# EAGLE design working (EAGLE 9.6.2)
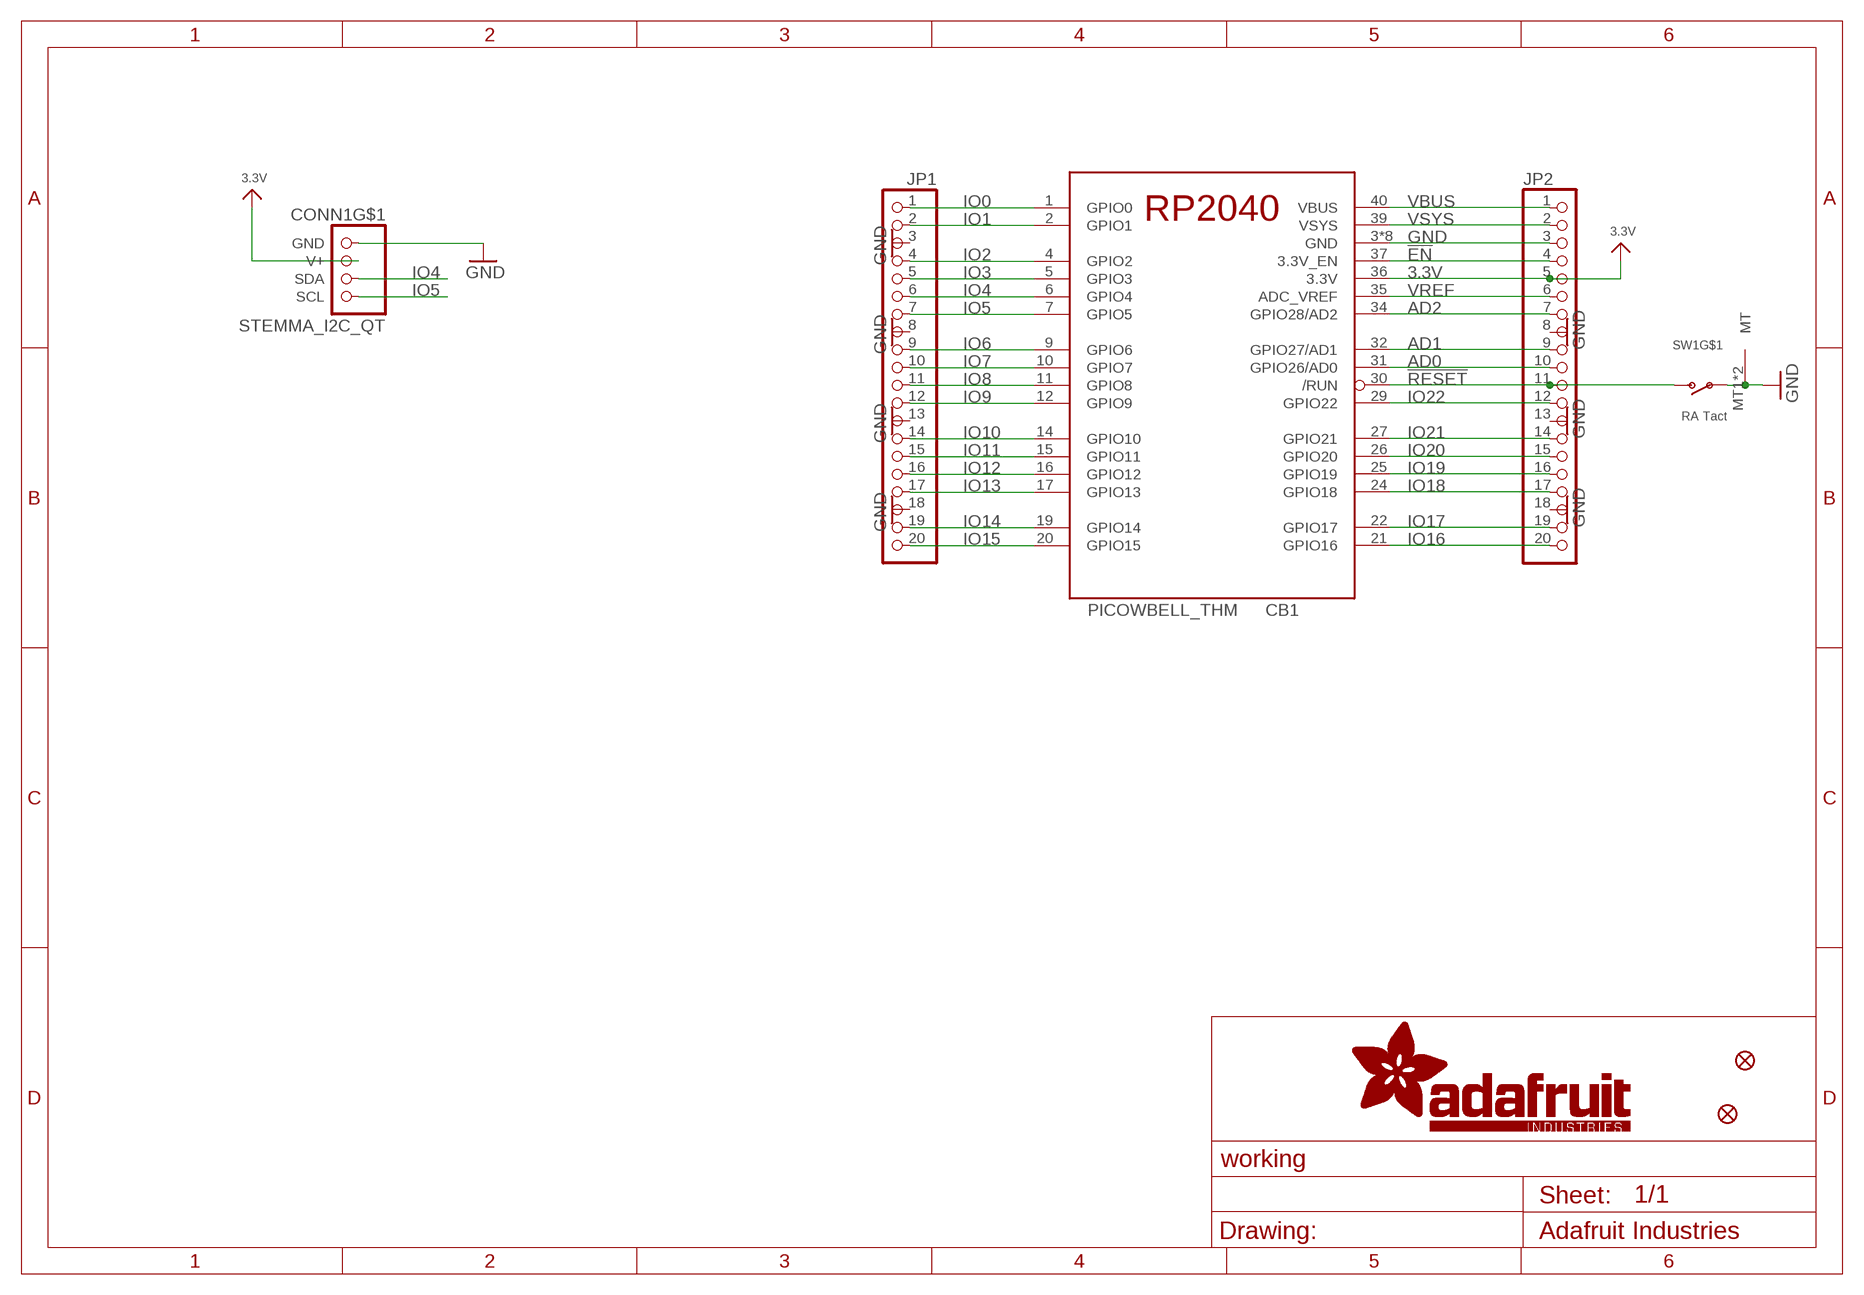
[diagram p0: schematic, sheet 1]

## Parts
CB1  PICOWBELL_THM  [PICOWBELL]
CONN1  STEMMA_I2C_QT  [JST_SH4]
FID1  FIDUCIAL_1MM  [FIDUCIAL_1MM]
FID2  FIDUCIAL_1MM  [FIDUCIAL_1MM]
JP1  HEADER-1X20_70MIL  [1X20_ROUND_70MIL]
JP2  HEADER-1X20_70MIL  [1X20_ROUND_70MIL]
SW1  RA Tact  SWITCH_SPST_MNT_TACT_RA  [SPST_TACTILE_RA]

## Nets
3.3V: CB1.36(3.3V) CONN1.2(V+) JP2.5
!EN: CB1.37(3.3V_EN) JP2.4
!RESET: CB1.30(/RUN) JP2.11 SW1.2(S)
AD0: CB1.31(GPIO26/AD0) JP2.10
AD1: CB1.32(GPIO27/AD1) JP2.9
AD2: CB1.34(GPIO28/AD2) JP2.7
GND: CB1.3(GND) CB1.8(GND) CB1.13(GND) CB1.18(GND) CB1.23(GND) CB1.28(GND) CB1.33(GND) CB1.38(GND) CONN1.1(GND) JP1.3 JP1.8 JP1.13 JP1.18 JP2.3 JP2.8 JP2.13 JP2.18 SW1.1(P) SW1.MT1(MT) SW1.MT2(MT)
IO0: CB1.1(GPIO0) JP1.1
IO1: CB1.2(GPIO1) JP1.2
IO2: CB1.4(GPIO2) JP1.4
IO3: CB1.5(GPIO3) JP1.5
IO4: CB1.6(GPIO4) CONN1.3(SDA) JP1.6
IO5: CB1.7(GPIO5) CONN1.4(SCL) JP1.7
IO6: CB1.9(GPIO6) JP1.9
IO7: CB1.10(GPIO7) JP1.10
IO8: CB1.11(GPIO8) JP1.11
IO9: CB1.12(GPIO9) JP1.12
IO10: CB1.14(GPIO10) JP1.14
IO11: CB1.15(GPIO11) JP1.15
IO12: CB1.16(GPIO12) JP1.16
IO13: CB1.17(GPIO13) JP1.17
IO14: CB1.19(GPIO14) JP1.19
IO15: CB1.20(GPIO15) JP1.20
IO16: CB1.21(GPIO16) JP2.20
IO17: CB1.22(GPIO17) JP2.19
IO18: CB1.24(GPIO18) JP2.17
IO19: CB1.25(GPIO19) JP2.16
IO20: CB1.26(GPIO20) JP2.15
IO21: CB1.27(GPIO21) JP2.14
IO22: CB1.29(GPIO22) JP2.12
VBUS: CB1.40(VBUS) JP2.1
VREF: CB1.35(ADC_VREF) JP2.6
VSYS: CB1.39(VSYS) JP2.2
Unconnected: CONN1.MT1(MT) CONN1.MT2(MT)

## Library data of the parts
CB1 = adafruit_micro:PICOWBELL
CONN1 = adafruit_electromech:STEMMA_I2C; LCSC: C2845363
FID1 FID2 = microbuilder:FIDUCIAL: Fiducial Alignment Points Various fiducial points for machine vision alignment.; BOM: EXCLUDE
JP1 JP2 = adafruit_electromech:HEADER-1X20
SW1 = adafruit_electromech:SWITCH_SPST_MNT: Switch - SPST 4UCon 19192 (6.7x2.6mm SMT); LCSC: C778158

## Board
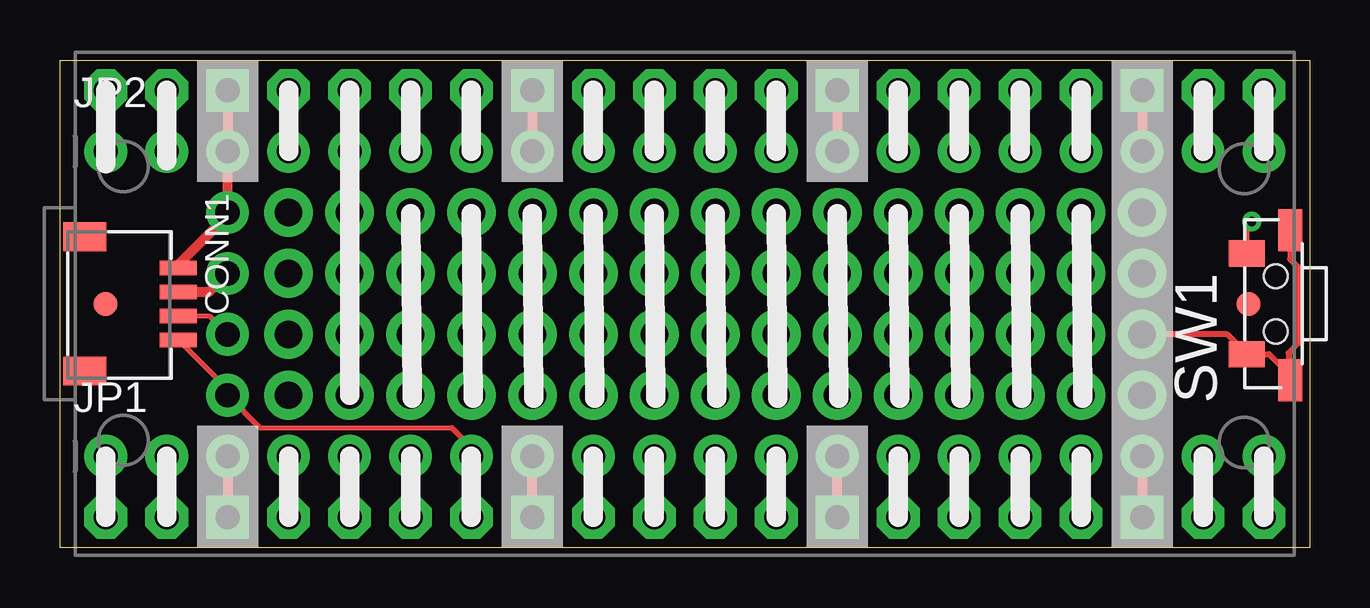
[diagram p1: board, top side]
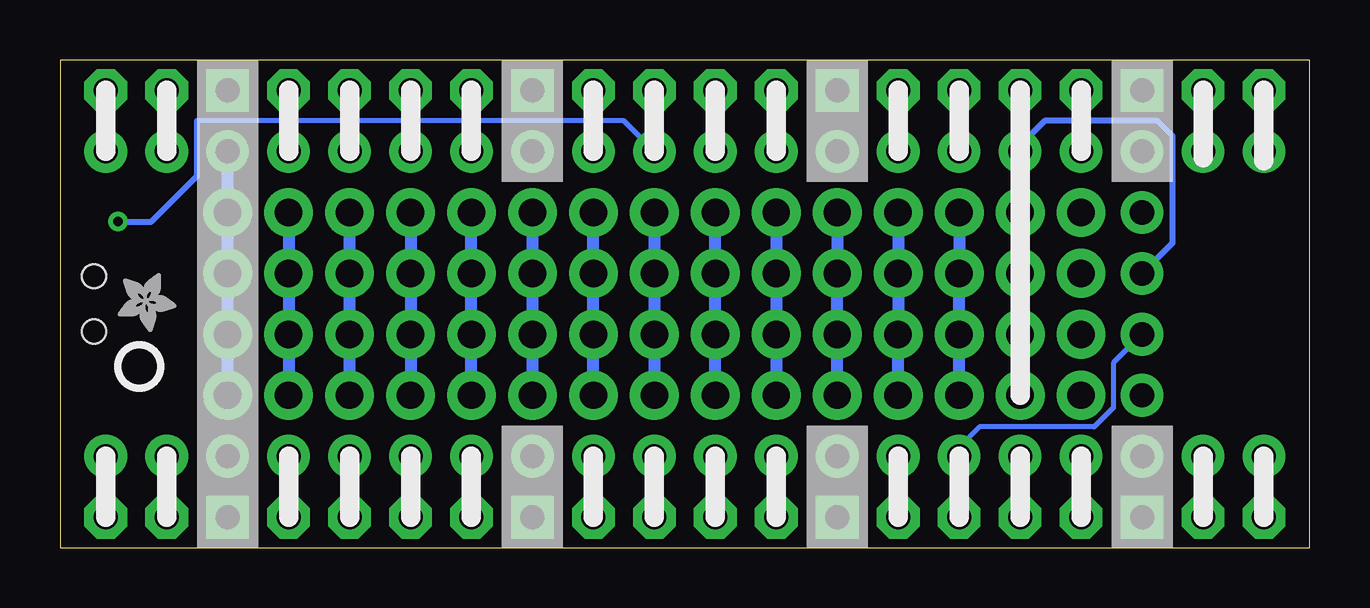
[diagram p2: board, bottom side, seen from below]

Size 52.07 x 20.32 mm. Coordinates in mm from the lower left corner, seen from the top.
Outline: 0,0 0,20.32 52.07,20.32 52.07,0 0,0
Copper layers (1*16): Top 0.035mm / dielectric 1.5mm / Bottom 0.035mm
Design rules "adafruit": minimum track width 8mil, minimum drill 15.5mil, track to track 8mil, track to pad 8mil, pad to pad 8mil, via to via 8mil, smd to smd 8mil, copper to edge 10mil, drill to drill 8mil, minimum pad ring 10mil, minimum via ring 8mil, stop-mask expansion 2mil, vias tented up to drill 20mil, thermal gap 10mil

### Footprints (pad centres in the part's own frame; a part is rotated, then mirrored left to right if it is on the bottom)
PICOWBELL = drill 1 pad 1.778 octagon: 1 1.27,0; 2 3.81,0; 4 8.89,0; 5 11.43,0; 6 13.97,0; 7 16.51,0; 9 21.59,0; 10 24.13,0; 11 26.67,0; 12 29.21,0; 14 34.29,0; 15 36.83,0; 16 39.37,0; 17 41.91,0; 19 46.99,0; 20 49.53,0; 21 49.53,17.78; 22 46.99,17.78; 24 41.91,17.78; 25 39.37,17.78; 26 36.83,17.78; 27 34.29,17.78; 29 29.21,17.78; 30 26.67,17.78; 31 24.13,17.78; 32 21.59,17.78; 34 16.51,17.78; 35 13.97,17.78; 36 11.43,17.78; 37 8.89,17.78; 39 3.81,17.78; 40 1.27,17.78 | drill 1 pad 1.778 square: 3 6.35,0; 8 19.05,0; 13 31.75,0; 18 44.45,0; 23 44.45,17.78; 28 31.75,17.78; 33 19.05,17.78; 38 6.35,17.78
JST_SH4 = smd 0.6 x 1.55: 1 -1.5,2.006; 2 -0.5,2.006; 3 0.5,2.006; 4 1.5,2.006 | smd 1.2 x 1.8: MT1 -2.8,-1.894; MT2 2.8,-1.894
FIDUCIAL_1MM = smd 1 x 1: 1 0,0
1X20_ROUND_70MIL = drill 1 pad 1.778: 1 -24.13,0; 2 -21.59,0; 3 -19.05,0; 4 -16.51,0; 5 -13.97,0; 6 -11.43,0; 7 -8.89,0; 8 -6.35,0; 9 -3.81,0; 10 -1.27,0; 11 1.27,0; 12 3.81,0; 13 6.35,0; 14 8.89,0; 15 11.43,0; 16 13.97,0; 17 16.51,0; 18 19.05,0; 19 21.59,0; 20 24.13,0
SPST_TACTILE_RA = smd 1.1 x 1.5: 1 2.1,-0.9; 2 -2.1,-0.9 | smd 1.75 x 1: MT1 3.175,0.9; MT2 -3.075,0.9 | hole 1: 1.15,0.3; -1.15,0.3

### Placement (x,y rotation side)
CB1  0.64,1.27 0 top
CONN1  2.92,10.16 270 top
FID1  1.91,10.16 0 top
FID2  49.53,10.16 0 top
JP1  26.04,3.81 0 top
JP2  26.04,16.51 0 top
PLABEL0  [PLABEL0]  47.88,10.16 270 top
PLABEL1  [PLABEL1]  3.43,2.54 0 top
PLABEL2  [PLABEL2]  0.89,2.54 0 top
PLABEL3  [PLABEL3]  8.7,2.6 0 top
PLABEL4  [PLABEL4]  11.05,2.54 0 top
PLABEL5  [PLABEL5]  13.59,2.54 0 top
PLABEL6  [PLABEL6]  16.13,2.54 0 top
PLABEL7  [PLABEL7]  21.4,2.54 0 top
PLABEL8  [PLABEL8]  23.75,2.54 0 top
PLABEL9  [PLABEL9]  26.29,2.54 0 top
PLABEL10  [PLABEL10]  28.83,2.54 0 top
PLABEL11  [PLABEL11]  0.64,17.78 90 top
PLABEL12  [PLABEL12]  3.17,17.78 90 top
PLABEL13  [PLABEL13]  10.79,17.78 90 top
PLABEL14  [PLABEL14]  26.29,17.78 0 top
PLABEL15  [PLABEL15]  50.1,5.4 0 top
PLABEL16  [PLABEL16]  47.56,5.4 0 top
PLABEL17  [PLABEL17]  50.1,14.99 0 top
PLABEL18  [PLABEL18]  47.62,14.86 0 top
PLABEL19  [PLABEL19]  28.57,17.78 90 top
PLABEL20  [PLABEL20]  36.2,17.78 90 top
PLABEL21  [PLABEL21]  41.27,17.78 90 top
PLABEL22  [PLABEL22]  36.2,2.54 90 top
PLABEL23  [PLABEL23]  41.27,2.54 90 top
PLABEL24  [PLABEL24]  38.73,17.78 90 top
PLABEL25  [PLABEL25]  38.73,2.54 90 top
PLABEL26  [PLABEL26]  23.5,17.72 90 top
PLABEL27  [PLABEL27]  15.81,17.65 90 top
PLABEL28  [PLABEL28]  13.34,17.78 90 top
PLABEL29  [PLABEL29]  0.06,13.84 0 top
PLABEL30  [PLABEL30]  0.13,5.27 0 top
PLABEL31  [PLABEL31]  5.52,6.35 0 top
PLABEL32  [PLABEL32]  6.03,12.57 90 top
PLABEL33  [PLABEL33]  5.91,7.81 90 top
PLABEL34  [PLABEL34]  5.46,13.97 0 top
PLABEL35  [PLABEL35]  2.16,10.16 90 bottom
PLABEL36  [PLABEL36]  3.43,2.54 0 bottom
PLABEL37  [PLABEL37]  0.89,2.54 0 bottom
PLABEL38  [PLABEL38]  8.64,2.6 0 bottom
PLABEL39  [PLABEL39]  11.05,2.54 0 bottom
PLABEL40  [PLABEL40]  13.59,2.54 0 bottom
PLABEL41  [PLABEL41]  16.13,2.54 0 bottom
PLABEL42  [PLABEL42]  21.46,2.54 0 bottom
PLABEL43  [PLABEL43]  23.75,2.54 0 bottom
PLABEL44  [PLABEL44]  26.29,2.54 0 bottom
PLABEL45  [PLABEL45]  28.83,2.54 0 bottom
PLABEL46  [PLABEL46]  0.64,17.78 90 bottom
PLABEL47  [PLABEL47]  3.17,17.78 90 bottom
PLABEL48  [PLABEL48]  10.79,17.78 90 bottom
PLABEL49  [PLABEL49]  26.29,17.78 0 bottom
PLABEL50  [PLABEL50]  50.16,5.4 0 bottom
PLABEL51  [PLABEL51]  47.69,5.33 0 bottom
PLABEL52  [PLABEL52]  50.16,14.99 0 bottom
PLABEL53  [PLABEL53]  47.62,14.92 0 bottom
PLABEL54  [PLABEL54]  28.57,17.78 90 bottom
PLABEL55  [PLABEL55]  36.2,17.78 90 bottom
PLABEL56  [PLABEL56]  41.27,17.78 90 bottom
PLABEL57  [PLABEL57]  36.2,2.54 90 bottom
PLABEL58  [PLABEL58]  41.27,2.54 90 bottom
PLABEL59  [PLABEL59]  38.73,17.78 90 bottom
PLABEL60  [PLABEL60]  38.73,2.54 90 bottom
PLABEL61  [PLABEL61]  23.5,17.78 90 bottom
PLABEL62  [PLABEL62]  15.75,17.91 90 bottom
PLABEL63  [PLABEL63]  13.34,17.78 90 bottom
PLABEL64  [PLABEL64]  5.46,13.97 90 bottom
PLABEL65  [PLABEL65]  5.46,11.43 90 bottom
PLABEL66  [PLABEL66]  5.46,8.89 90 bottom
PLABEL67  [PLABEL67]  5.46,6.35 90 bottom
SW1  50.36,10.16 270 top
U$2  [ADAFRUIT_2.5MM]  49.66,11.43 270 bottom
U$6  [PCBFEAT-REV-040]  48.77,7.56 90 bottom

### Tracks (layer width: path | path; a pad name or v marks a point on that pad's centre or on a via)
3.3V  (via drill 1.02 pad 1.78, 1.14 pad 2.03)
  Top 0.406: CONN1.2 6.21,10.66 v6.99,11.43
  Top 0.813: CB1.36 JP2.5 v12.06,13.97 v12.06,11.43 v12.06,8.89 v12.06,6.35
  Bottom 0.254: v6.99,11.43 5.71,12.7 5.71,17.14 6.35,17.78 11.05,17.78 12.06,16.76 JP2.5
!EN
  Top 0.406: CB1.37 JP2.4
!RESET  (via drill 0.39)
  Top 0.254: SW1.2 49.46,13.39 v49.66,13.59
  Top 0.406: CB1.30 JP2.11
  Bottom 0.203: JP2.11 28.57,17.78 46.35,17.78
  Bottom 0.254: v49.66,13.59 48.26,13.59 46.35,15.49 46.35,17.78
AD0
  Top 0.406: CB1.31 JP2.10
AD1
  Top 0.406: CB1.32 JP2.9
AD2
  Top 0.406: CB1.34 JP2.7
GND  (via drill 1.02 pad 1.78, 1.14 pad 2.03)
  Top 0.203: 6.99,13.72 6.99,13.84 v6.99,13.97
  Top 0.254: SW1.MT2 51.26,12.02 51.6,11.68 51.6,8.52 51.19,8.11 51.19,7.24 | SW1.MT1 51.26,7.18 51.19,7.24 | 51.19,7.24 50.37,8.06 SW1.1 48.63,8.89 v45.09,8.89
  Top 0.406: JP1.3 CB1.3 | CB1.8 JP1.8 | CB1.13 JP1.13 | JP1.18 CB1.18 | CB1.23 JP2.18 | CB1.28 JP2.13 | CB1.33 JP2.8 | CB1.38 JP2.3 v6.99,13.97 | CONN1.1 4.93,11.79 6.99,13.84
  Bottom 0.203: 45.09,3.43 JP1.18
  Bottom 0.508: v45.09,6.35 v45.09,8.89 v45.09,11.43 v45.09,13.97 JP2.18
IO0
  Top 0.406: JP1.1 CB1.1
IO1
  Top 0.406: CB1.2 JP1.2
IO2
  Top 0.406: CB1.4 JP1.4
IO3
  Top 0.406: JP1.5 CB1.5
IO4  (via drill 1.02 pad 1.78)
  Top 0.203: CONN1.3 6.21,9.66 v6.99,8.89
  Top 0.406: CB1.6 JP1.6
  Bottom 0.203: v6.99,8.89 8.18,7.7 8.18,5.83 8.98,5.03 13.77,5.03 14.61,4.19 JP1.6
IO5  (via drill 1.02 pad 1.78)
  Top 0.203: CONN1.4 6.99,6.6 v6.99,6.35 8.33,5 16.33,5 17.14,4.19 JP1.7
  Top 0.406: JP1.7 CB1.7
IO6
  Top 0.406: CB1.9 JP1.9
IO7
  Top 0.406: CB1.10 JP1.10
IO8
  Top 0.406: CB1.11 JP1.11
IO9
  Top 0.406: CB1.12 JP1.12
IO10
  Top 0.406: CB1.14 JP1.14
IO11
  Top 0.406: CB1.15 JP1.15
IO12
  Top 0.406: CB1.16 JP1.16
IO13
  Top 0.406: CB1.17 JP1.17
IO14
  Top 0.406: CB1.19 JP1.19
IO15
  Top 0.406: CB1.20 JP1.20
IO16
  Top 0.406: CB1.21 JP2.20
IO17
  Top 0.406: CB1.22 JP2.19
IO18
  Top 0.406: CB1.24 JP2.17
IO19
  Top 0.406: CB1.25 JP2.16
IO20
  Top 0.406: CB1.26 JP2.15
IO21
  Top 0.406: CB1.27 JP2.14
IO22
  Top 0.406: CB1.29 JP2.12
N$49  (via drill 1.14 pad 2.03)
  other vias: 9.53,6.35
N$50  (via drill 1.14 pad 2.03)
  other vias: 9.53,8.89
N$51  (via drill 1.14 pad 2.03)
  other vias: 9.53,11.43
N$52  (via drill 1.14 pad 2.03)
  other vias: 9.53,13.97
PR1  (via drill 1.14 pad 2.03)
  Bottom 0.508: v14.61,13.97 v14.61,11.43 v14.61,8.89 v14.61,6.35
PR2  (via drill 1.14 pad 2.03)
  Bottom 0.508: v17.14,13.97 v17.14,11.43 v17.14,8.89 v17.14,6.35
PR3  (via drill 1.14 pad 2.03)
  Bottom 0.508: v19.68,6.35 v19.68,8.89 v19.68,11.43 v19.68,13.97
PR4  (via drill 1.14 pad 2.03)
  Bottom 0.508: v22.23,13.97 v22.23,11.43 v22.23,8.89 v22.23,6.35
PR5  (via drill 1.14 pad 2.03)
  Bottom 0.508: v24.77,6.35 v24.77,8.89 v24.77,11.43 v24.77,13.97
PR6  (via drill 1.14 pad 2.03)
  Bottom 0.508: v27.3,13.97 v27.3,11.43 v27.3,8.89 v27.3,6.35
PR7  (via drill 1.14 pad 2.03)
  Bottom 0.508: v29.84,6.35 v29.84,8.89 v29.84,11.43 v29.84,13.97
PR8  (via drill 1.14 pad 2.03)
  Bottom 0.508: v32.38,13.97 v32.38,11.43 v32.38,8.89 v32.38,6.35
PR9  (via drill 1.14 pad 2.03)
  Bottom 0.508: v34.92,6.35 v34.92,8.89 v34.92,11.43 v34.92,13.97
PR10  (via drill 1.14 pad 2.03)
  Bottom 0.508: v37.47,13.97 v37.47,11.43 v37.47,8.89 v37.47,6.35
PR11  (via drill 1.14 pad 2.03)
  Bottom 0.508: v40.01,6.35 v40.01,8.89 v40.01,11.43 v40.01,13.97
PR12  (via drill 1.14 pad 2.03)
  Bottom 0.508: v42.55,13.97 v42.55,11.43 v42.55,8.89 v42.55,6.35
VBUS
  Top 0.813: CB1.40 JP2.1
VREF
  Top 0.406: CB1.35 JP2.6
VSYS
  Top 0.813: CB1.39 JP2.2

### Text on the board
Pinguin_tBackup: VB | VS | 3V | Vr | A2 | A0 | R | 22 | 20 | 19 | 18 | 17 | 16 | I2C | G | 3 | RESET | D | C | QT | 0 | 1 | 2 | 3 | 4 | 5 | 6 | 7 | 8 | 9 | 11 | 12 | 13 | 14 | 15
Pinguin_bBackup: VB | VS | 3V | Vr | A2 | A0 | R | 22 | 20 | 19 | 18 | 17 | 16 | GN | 3V | Prototyping / PiCowbell | DA | CL | 0 | 1 | 2 | 3 | 4 | 5 | 6 | 7 | 8 | 9 | 11 | 12 | 13 | 14 | 15